# Altium schematic sheet Sheet_ALI.SchDoc
size A3
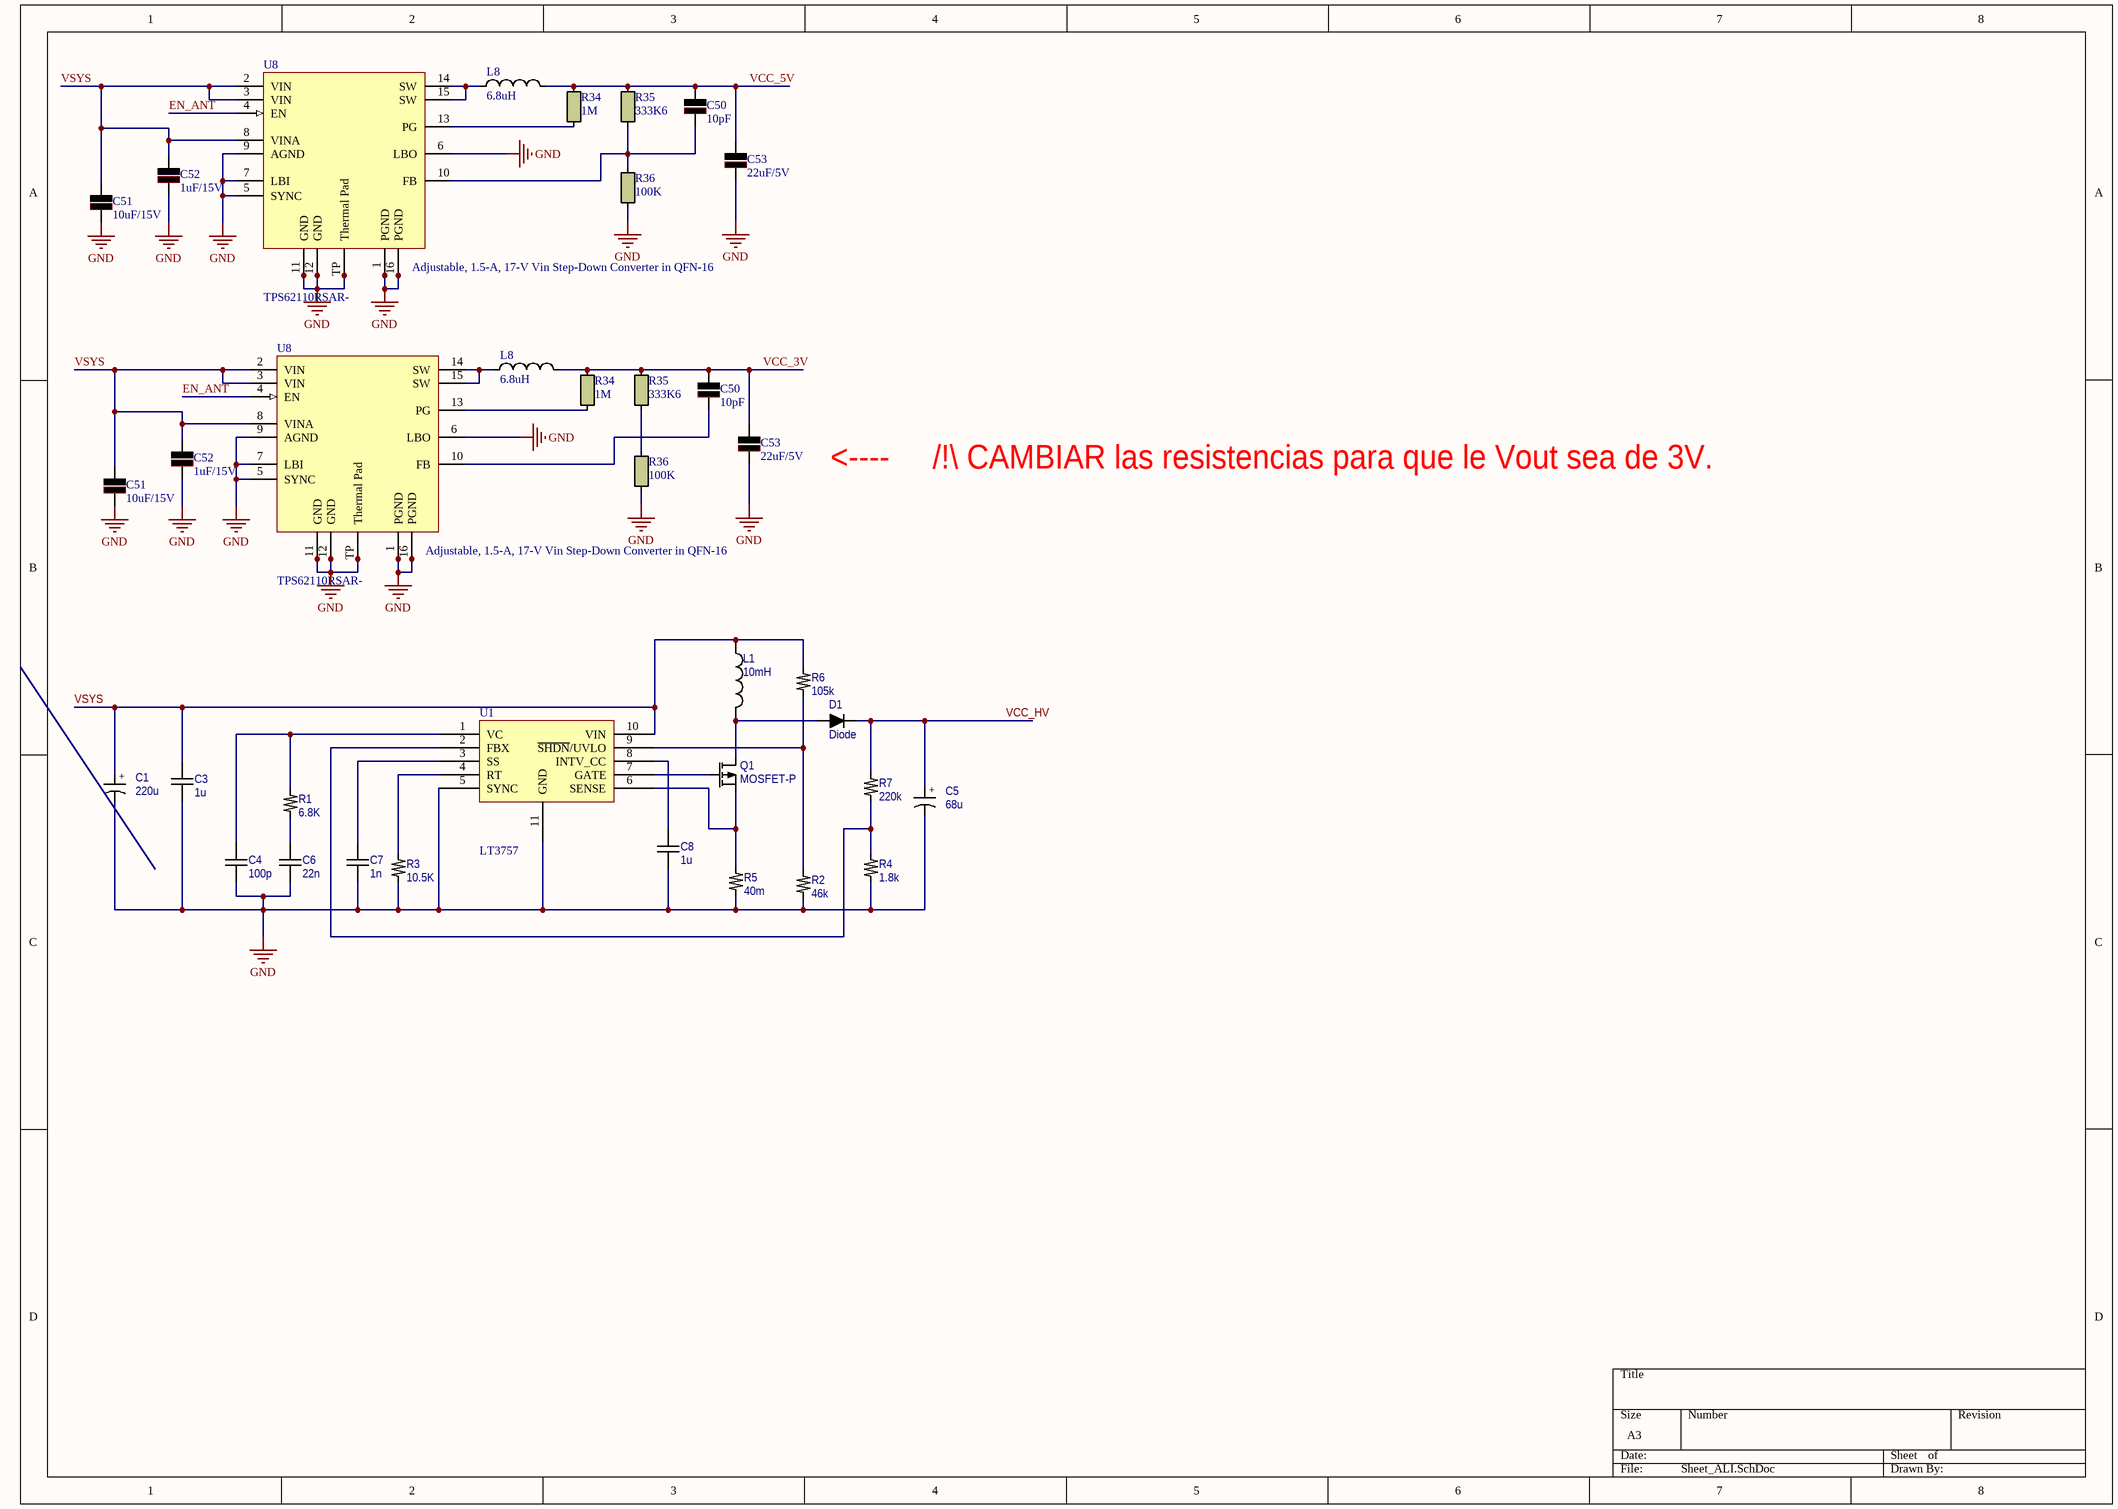
[diagram p0: Sheet_ALI.SchDoc]

## Parts
(Parts that share a designator on the sheet are numbered #1, #2 ... from top to bottom, then left to right.)
C1  220u  [C_SMD_D10H10]
C3  1u  [C_0805]
C4  100p  [C_0805]
C5  68u  [C_D18H25]
C6  22n  [C_0805]
C7  1n  [C_0805]
C8  1u  [C_0805]
C50#1  10pF  [C_0402]
C50#2  10pF  [C_0402]
C51#1  10uF/15V  [C_0805]
C51#2  10uF/15V  [C_0805]
C52#1  1uF/15V  [C_0805]
C52#2  1uF/15V  [C_0805]
C53#1  22uF/5V  [C_0805]
C53#2  22uF/5V  [C_0805]
D1  Diode  [D_PowerDI5]
L1  10mH  [L_NS10155]
L8#1  6.8uH  [L_TDK_SLF_6.8u]
L8#2  6.8uH  [L_TDK_SLF_6.8u]
Q1  MOSFET-P  [D2PAk]
R1  6.8K  [R_0805]
R2  46k  [R_0805]
R3  10.5K  [R_0805]
R4  1.8k  [C_1206]
R5  40m  [C_1206]
R6  105k  [R_0805]
R7  220k  [R_2010]
R34#1  1M  [R_0402]
R34#2  1M  [R_0402]
R35#1  333K6  [R_0402]
R35#2  333K6  [R_0402]
R36#1  100K  [R_0402]
R36#2  100K  [R_0402]
U1  LT3757  [MSOP10+1]
U8#1  Adjustable, 1.5-A, 17-V Vin Step-Down Converter in QFN-16  Part Number: TPS62110RSAR-  [TPS62110]
U8#2  Adjustable, 1.5-A, 17-V Vin Step-Down Converter in QFN-16  Part Number: TPS62110RSAR-  [TPS62110]

## Nets
GND: C1.1 C3.1 C4.1 C5.1 C6.1 C7.1 C8.1 C51#1.2 C51#2.2 C52#1.2 C52#2.2 C53#1.2 C53#2.2 R2.1 R3.1 R4.1 R5.1 R36#1.1 R36#2.1 U1.5(SYNC) U1.11(GND) U8#1.1(PGND) U8#1.5(SYNC) U8#1.6(LBO) U8#1.7(LBI) U8#1.9(AGND) U8#1.11(GND) U8#1.12(GND) U8#1.16(PGND) U8#1.TP(Thermal_Pad) U8#2.1(PGND) U8#2.5(SYNC) U8#2.6(LBO) U8#2.7(LBI) U8#2.9(AGND) U8#2.11(GND) U8#2.12(GND) U8#2.16(PGND) U8#2.TP(Thermal_Pad)
EN_ANT: U8#1.4(EN) U8#2.4(EN)
VCC_3V: C50#2.1 C53#2.1 L8#2.2 R34#2.2 R35#2.2
VCC_5V: C50#1.1 C53#1.1 L8#1.2 R34#1.2 R35#1.2
VCC_HV: C5.2 D1.3 R7.2
VSYS: C1.2 C3.2 C51#1.1 C51#2.1 C52#1.1 C52#2.1 L1.1 R6.2 U1.10(VIN) U8#1.2(VIN) U8#1.3(VIN) U8#1.8(VINA) U8#2.2(VIN) U8#2.3(VIN) U8#2.8(VINA)
NetC4_2: C4.2 R1.2 U1.1(VC)
NetC6_2: C6.2 R1.1
NetC7_2: C7.2 U1.3(SS)
NetC8_2: C8.2 U1.8(INTV_CC)
NetC50#1_2: C50#1.2 R35#1.1 R36#1.2 U8#1.10(FB)
NetC50#2_2: C50#2.2 U8#2.10(FB)
NetD1_1: D1.1 L1.2 Q1.2(D)
NetL8#1_1: L8#1.1 U8#1.14(SW) U8#1.15(SW)
NetL8#2_1: L8#2.1 U8#2.14(SW) U8#2.15(SW)
NetQ1_1: Q1.1(G) U1.7(GATE)
NetQ1_3: Q1.3(S) R5.2 U1.6(SENSE)
NetR2_2: R2.2 R6.1 U1.9(~{SHDN}/UVLO)
NetR3_2: R3.2 U1.4(RT)
NetR4_2: R4.2 R7.1 U1.2(FBX)
NetR34#1_1: R34#1.1 U8#1.13(PG)
NetR34#2_1: R34#2.1 U8#2.13(PG)
NetR35#2_1: R35#2.1 R36#2.2

## Notes on the sheet
- <----     /!\ CAMBIAR las resistencias para que le Vout sea de 3V.
- (in symbol Cap_Pol) +

## Library data of the parts
C1 C5 = Cap_Pol: Capacitor; Value: 100pF; Published: 8-Jun-2000; LatestRevisionDate: 17-Jul-2002; LatestRevisionNote: Re-released for DXP Platform.; PackageReference: RAD-0.3; Publisher: Altium Limited
C3 C4 C6-C8 = Cap: Capacitor; Value: 100pF; Published: 8-Jun-2000; LatestRevisionDate: 17-Jul-2002; LatestRevisionNote: Re-released for DXP Platform.; PackageReference: RAD-0.3; Publisher: Altium Limited
C50#1 C50#2 C51#1 C51#2 C52#1 C52#2 C53#1 C53#2 = C: Precio: 0,553; Código Mouser: 647-UCL1E331MNL1GS
L1 = Inductor: Code_IEC: 1005; Published: 8-Jun-2000; LatestRevisionDate: 29-May-2009; LatestRevisionNote: IPC-7351 Footprint Added.; PackageReference: 0402-A; Publisher: Altium Limited; PackageDescription: Chip Inductor; Code_JEITA: 0402; Value: 10mH
L8#1 L8#2 = L: Precio: 0,59; Código Mouser: 652-SDR1005-331KL
Q1 = MOSFET-P: P-Channel MOSFET; Published: 8-Jun-2000; LatestRevisionDate: 17-Jul-2002; LatestRevisionNote: Re-released for DXP Platform.; PackageVersion: 1995/1996; PackageReference: E3; Publisher: Altium Limited; PackageDescription: TO, Flat Index; 3 In-Line, Axial Leads; Body Dia. 4.6mm; Lead Dia. 0.5 mm (max)
R1-R7 = Res: Resistor; Value: 1K; Published: 8-Jun-2000; LatestRevisionDate: 29-May-2009; LatestRevisionNote: IPC-7351 Footprint Added.; PackageReference: J1-0603; Publisher: Altium Limited; PackageDescription: Chip Resistor
R34#1 R34#2 R35#1 R35#2 R36#1 R36#2 = R: Precio: 0,05; Código Mouser: Variable
U8#1 U8#2 = TPS62110: Supplier 1: Digi-Key; Supplier Part Number 1: 296-24839-1-ND
D1 = Diode: Published: 8-Jun-2000; LatestRevisionDate: 17-Jul-2002; LatestRevisionNote: Re-released for DXP Platform.; DatasheetVersion: 1998; PackageVersion: Aug-1999; PackageReference: DO-41; Publisher: Altium Limited; PackageDescription: Diode, Axial; Body 5.2 x 2.7 mm (LxDia. max), Lead Dia. 0.86 mm (max); Code_JEDEC: DO-204-AL; ComponentLink1Description: Manufacturer Link; ComponentLink1URL: http://www.fairchildsemi.com/; ComponentLink2Description: Datasheet; ComponentLink2URL: http://www.fairchildsemi.com/ds/1N%2F1N4001.pdf